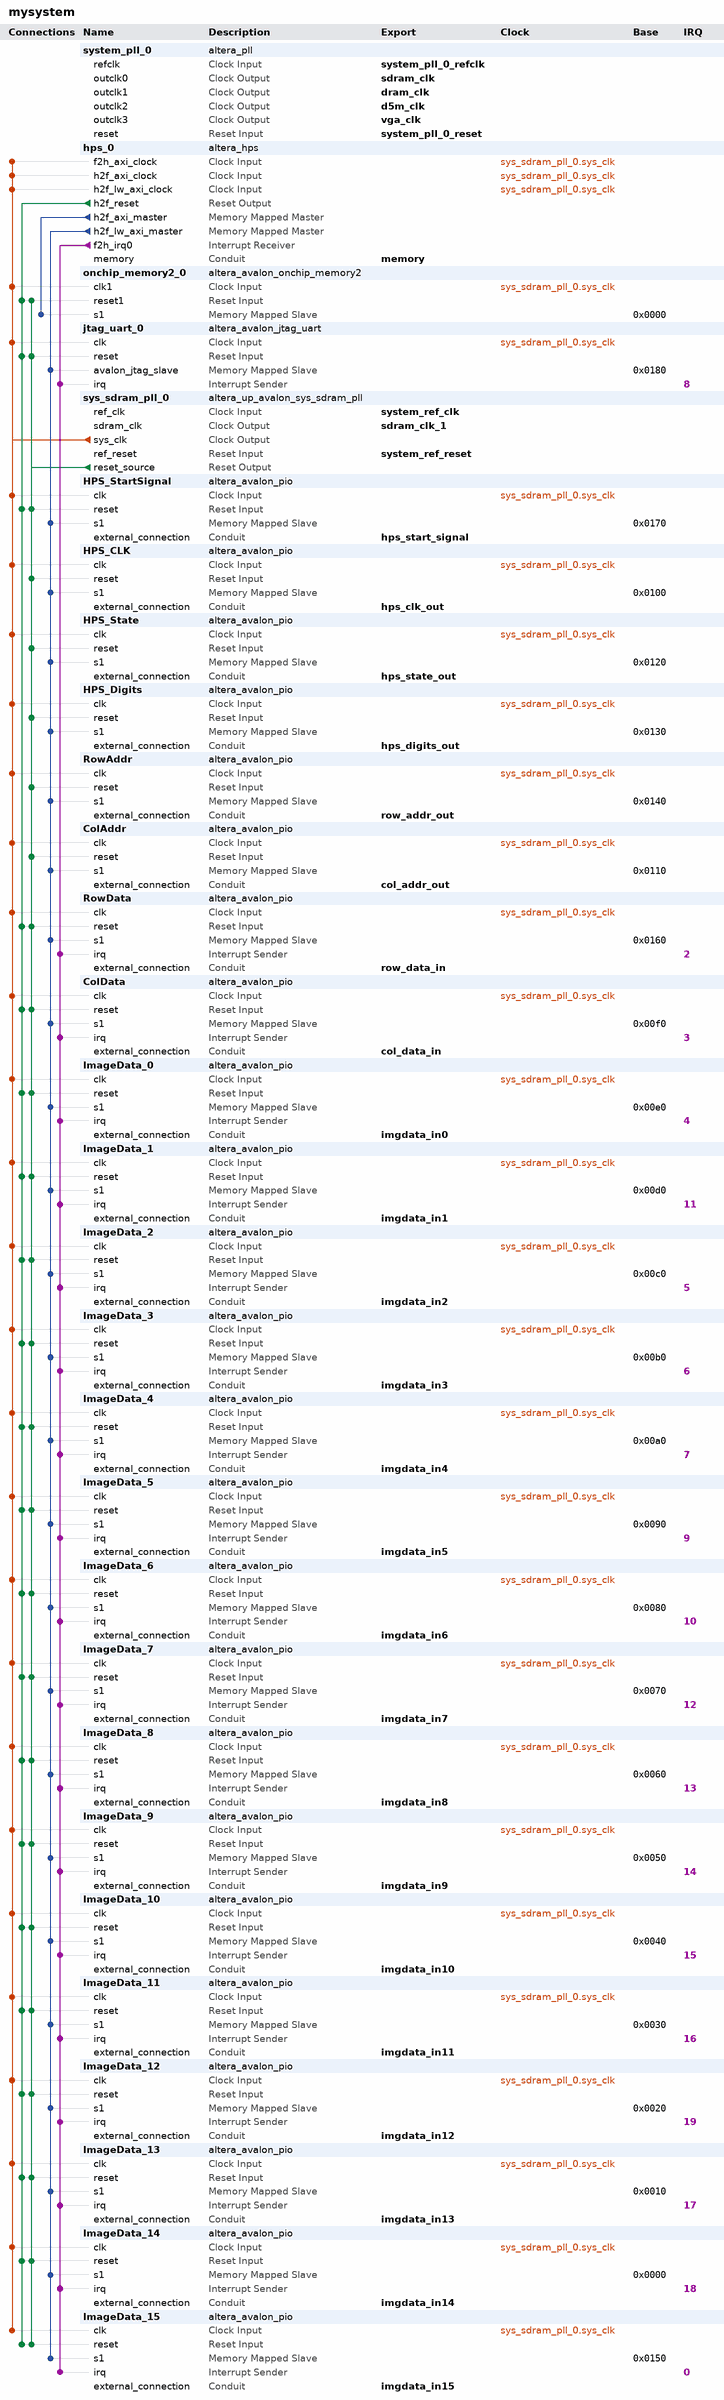
[diagram p0: system contents]
# Platform Designer (Qsys) system mysystem, Cyclone V 5CSEMA5F31C6
# Parameters at their usual value, and those the tool derives, are not listed.
package require -exact qsys 13.1
create_system mysystem
set_project_property DEVICE_FAMILY {Cyclone V}
set_project_property DEVICE 5CSEMA5F31C6

add_instance system_pll_0 altera_pll 13.1
set_instance_parameter_value system_pll_0 gui_device_speed_grade 2
set_instance_parameter_value system_pll_0 gui_pll_mode {Integer-N PLL}
set_instance_parameter_value system_pll_0 gui_reference_clock_frequency 50.0
set_instance_parameter_value system_pll_0 gui_operation_mode direct
set_instance_parameter_value system_pll_0 gui_use_locked false
set_instance_parameter_value system_pll_0 gui_number_of_clocks 4
set_instance_parameter_value system_pll_0 gui_output_clock_frequency0 100.0
set_instance_parameter_value system_pll_0 gui_output_clock_frequency1 100.0
set_instance_parameter_value system_pll_0 gui_ps_units1 degrees
set_instance_parameter_value system_pll_0 gui_phase_shift_deg1 -90.0
set_instance_parameter_value system_pll_0 gui_output_clock_frequency2 25.0
set_instance_parameter_value system_pll_0 gui_output_clock_frequency3 25.0

add_instance hps_0 altera_hps 13.1
set_instance_parameter_value hps_0 MEM_VENDOR JEDEC
set_instance_parameter_value hps_0 MEM_CLK_FREQ_MAX 400.0
set_instance_parameter_value hps_0 MEM_ROW_ADDR_WIDTH 12
set_instance_parameter_value hps_0 MEM_COL_ADDR_WIDTH 8
set_instance_parameter_value hps_0 MEM_DQ_WIDTH 8
set_instance_parameter_value hps_0 MEM_BANKADDR_WIDTH 3
set_instance_parameter_value hps_0 MEM_DRV_STR RZQ/6
set_instance_parameter_value hps_0 MEM_RTT_NOM RZQ/6
set_instance_parameter_value hps_0 MEM_RTT_WR {Dynamic ODT off}
set_instance_parameter_value hps_0 MEM_WTCL 6
set_instance_parameter_value hps_0 MEM_TCL 7
set_instance_parameter_value hps_0 TIMING_TIS 175
set_instance_parameter_value hps_0 TIMING_TIH 250
set_instance_parameter_value hps_0 TIMING_TDS 50
set_instance_parameter_value hps_0 TIMING_TDH 125
set_instance_parameter_value hps_0 TIMING_TDQSQ 120
set_instance_parameter_value hps_0 TIMING_TDQSCK 400
set_instance_parameter_value hps_0 TIMING_TQSH 0.38
set_instance_parameter_value hps_0 MEM_TINIT_US 499
set_instance_parameter_value hps_0 MEM_TMRD_CK 3
set_instance_parameter_value hps_0 MEM_TRAS_NS 40.0
set_instance_parameter_value hps_0 MEM_TRCD_NS 15.0
set_instance_parameter_value hps_0 MEM_TRP_NS 15.0
set_instance_parameter_value hps_0 MEM_TREFI_US 7.0
set_instance_parameter_value hps_0 MEM_TRFC_NS 75.0
set_instance_parameter_value hps_0 MEM_TWTR 2
set_instance_parameter_value hps_0 MEM_TFAW_NS 37.5
set_instance_parameter_value hps_0 REF_CLK_FREQ 125.0
set_instance_parameter_value hps_0 DEFAULT_FAST_SIM_MODEL true
set_instance_parameter_value hps_0 TIMING_BOARD_MAX_CK_DELAY 0.6
set_instance_parameter_value hps_0 TIMING_BOARD_MAX_DQS_DELAY 0.6
set_instance_parameter_value hps_0 TIMING_BOARD_SKEW_CKDQS_DIMM_MIN -0.01
set_instance_parameter_value hps_0 TIMING_BOARD_SKEW_CKDQS_DIMM_MAX 0.01
set_instance_parameter_value hps_0 TIMING_BOARD_SKEW_WITHIN_DQS 0.02
set_instance_parameter_value hps_0 TIMING_BOARD_SKEW_BETWEEN_DQS 0.02
set_instance_parameter_value hps_0 TIMING_BOARD_DQ_TO_DQS_SKEW 0.0
set_instance_parameter_value hps_0 TIMING_BOARD_AC_SKEW 0.02
set_instance_parameter_value hps_0 TIMING_BOARD_AC_TO_CK_SKEW 0.0
set_instance_parameter_value hps_0 MEM_CLK_FREQ 300.0
set_instance_parameter_value hps_0 HPS_PROTOCOL DDR3
set_instance_parameter_value hps_0 STM_Enable false
set_instance_parameter_value hps_0 F2S_Width 2
set_instance_parameter_value hps_0 S2F_Width 3
set_instance_parameter_value hps_0 LWH2F_Enable true
set_instance_parameter_value hps_0 F2SCLK_DBGRST_Enable false
set_instance_parameter_value hps_0 F2SCLK_WARMRST_Enable false
set_instance_parameter_value hps_0 F2SCLK_COLDRST_Enable false
set_instance_parameter_value hps_0 F2SINTERRUPT_Enable true
set_instance_parameter_value hps_0 EMAC1_PinMuxing Unused
set_instance_parameter_value hps_0 EMAC1_Mode N/A
set_instance_parameter_value hps_0 QSPI_PinMuxing Unused
set_instance_parameter_value hps_0 QSPI_Mode N/A
set_instance_parameter_value hps_0 SDIO_PinMuxing Unused
set_instance_parameter_value hps_0 SDIO_Mode N/A
set_instance_parameter_value hps_0 USB1_PinMuxing Unused
set_instance_parameter_value hps_0 USB1_Mode N/A
set_instance_parameter_value hps_0 SPIM1_PinMuxing Unused
set_instance_parameter_value hps_0 SPIM1_Mode N/A
set_instance_parameter_value hps_0 UART0_PinMuxing Unused
set_instance_parameter_value hps_0 UART0_Mode N/A
set_instance_parameter_value hps_0 I2C0_PinMuxing Unused
set_instance_parameter_value hps_0 I2C0_Mode N/A
set_instance_parameter_value hps_0 I2C1_PinMuxing Unused
set_instance_parameter_value hps_0 I2C1_Mode N/A
set_instance_parameter_value hps_0 S2FCLK_USER1CLK_FREQ 100
set_instance_parameter_value hps_0 FPGA_PERIPHERAL_OUTPUT_CLOCK_FREQ_EMAC0_MD_CLK 100
set_instance_parameter_value hps_0 FPGA_PERIPHERAL_OUTPUT_CLOCK_FREQ_EMAC0_GTX_CLK 100
set_instance_parameter_value hps_0 FPGA_PERIPHERAL_OUTPUT_CLOCK_FREQ_EMAC1_MD_CLK 100
set_instance_parameter_value hps_0 FPGA_PERIPHERAL_OUTPUT_CLOCK_FREQ_EMAC1_GTX_CLK 100

add_instance onchip_memory2_0 altera_avalon_onchip_memory2 13.1
set_instance_parameter_value onchip_memory2_0 dataWidth 32
set_instance_parameter_value onchip_memory2_0 dualPort false
set_instance_parameter_value onchip_memory2_0 initMemContent true
set_instance_parameter_value onchip_memory2_0 initializationFileName onchip_mem.hex
set_instance_parameter_value onchip_memory2_0 memorySize 16384

add_instance jtag_uart_0 altera_avalon_jtag_uart 13.1
set_instance_parameter_value jtag_uart_0 simInteractiveOptions NO_INTERACTIVE_WINDOWS

add_instance sys_sdram_pll_0 altera_up_avalon_sys_sdram_pll 13.1
set_instance_parameter_value sys_sdram_pll_0 gui_refclk 50.0
set_instance_parameter_value sys_sdram_pll_0 gui_outclk 50.0
set_instance_parameter_value sys_sdram_pll_0 CV_boards DE1-SoC

add_instance HPS_StartSignal altera_avalon_pio 13.1
set_instance_parameter_value HPS_StartSignal direction Output
set_instance_parameter_value HPS_StartSignal width 1

add_instance HPS_CLK altera_avalon_pio 13.1
set_instance_parameter_value HPS_CLK direction Output
set_instance_parameter_value HPS_CLK width 1

add_instance HPS_State altera_avalon_pio 13.1
set_instance_parameter_value HPS_State direction Output
set_instance_parameter_value HPS_State width 10

add_instance HPS_Digits altera_avalon_pio 13.1
set_instance_parameter_value HPS_Digits direction Output
set_instance_parameter_value HPS_Digits width 32

add_instance RowAddr altera_avalon_pio 13.1
set_instance_parameter_value RowAddr direction Output
set_instance_parameter_value RowAddr width 32

add_instance ColAddr altera_avalon_pio 13.1
set_instance_parameter_value ColAddr bitClearingEdgeCapReg true
set_instance_parameter_value ColAddr captureEdge true
set_instance_parameter_value ColAddr direction Output
set_instance_parameter_value ColAddr edgeType FALLING
set_instance_parameter_value ColAddr generateIRQ true
set_instance_parameter_value ColAddr irqType EDGE
set_instance_parameter_value ColAddr simDoTestBenchWiring true
set_instance_parameter_value ColAddr width 32

add_instance RowData altera_avalon_pio 13.1
set_instance_parameter_value RowData bitClearingEdgeCapReg true
set_instance_parameter_value RowData captureEdge true
set_instance_parameter_value RowData direction Input
set_instance_parameter_value RowData edgeType FALLING
set_instance_parameter_value RowData generateIRQ true
set_instance_parameter_value RowData irqType EDGE
set_instance_parameter_value RowData simDoTestBenchWiring true
set_instance_parameter_value RowData width 32

add_instance ColData altera_avalon_pio 13.1
set_instance_parameter_value ColData bitClearingEdgeCapReg true
set_instance_parameter_value ColData captureEdge true
set_instance_parameter_value ColData direction Input
set_instance_parameter_value ColData edgeType FALLING
set_instance_parameter_value ColData generateIRQ true
set_instance_parameter_value ColData irqType EDGE
set_instance_parameter_value ColData simDoTestBenchWiring true
set_instance_parameter_value ColData width 32

add_instance ImageData_0 altera_avalon_pio 13.1
set_instance_parameter_value ImageData_0 bitClearingEdgeCapReg true
set_instance_parameter_value ImageData_0 captureEdge true
set_instance_parameter_value ImageData_0 direction Input
set_instance_parameter_value ImageData_0 edgeType FALLING
set_instance_parameter_value ImageData_0 generateIRQ true
set_instance_parameter_value ImageData_0 irqType EDGE
set_instance_parameter_value ImageData_0 simDoTestBenchWiring true
set_instance_parameter_value ImageData_0 width 32

add_instance ImageData_1 altera_avalon_pio 13.1
set_instance_parameter_value ImageData_1 bitClearingEdgeCapReg true
set_instance_parameter_value ImageData_1 captureEdge true
set_instance_parameter_value ImageData_1 direction Input
set_instance_parameter_value ImageData_1 edgeType FALLING
set_instance_parameter_value ImageData_1 generateIRQ true
set_instance_parameter_value ImageData_1 irqType EDGE
set_instance_parameter_value ImageData_1 simDoTestBenchWiring true
set_instance_parameter_value ImageData_1 width 32

add_instance ImageData_2 altera_avalon_pio 13.1
set_instance_parameter_value ImageData_2 bitClearingEdgeCapReg true
set_instance_parameter_value ImageData_2 captureEdge true
set_instance_parameter_value ImageData_2 direction Input
set_instance_parameter_value ImageData_2 edgeType FALLING
set_instance_parameter_value ImageData_2 generateIRQ true
set_instance_parameter_value ImageData_2 irqType EDGE
set_instance_parameter_value ImageData_2 simDoTestBenchWiring true
set_instance_parameter_value ImageData_2 width 32

add_instance ImageData_3 altera_avalon_pio 13.1
set_instance_parameter_value ImageData_3 bitClearingEdgeCapReg true
set_instance_parameter_value ImageData_3 captureEdge true
set_instance_parameter_value ImageData_3 direction Input
set_instance_parameter_value ImageData_3 edgeType FALLING
set_instance_parameter_value ImageData_3 generateIRQ true
set_instance_parameter_value ImageData_3 irqType EDGE
set_instance_parameter_value ImageData_3 simDoTestBenchWiring true
set_instance_parameter_value ImageData_3 width 32

add_instance ImageData_4 altera_avalon_pio 13.1
set_instance_parameter_value ImageData_4 bitClearingEdgeCapReg true
set_instance_parameter_value ImageData_4 captureEdge true
set_instance_parameter_value ImageData_4 direction Input
set_instance_parameter_value ImageData_4 edgeType FALLING
set_instance_parameter_value ImageData_4 generateIRQ true
set_instance_parameter_value ImageData_4 irqType EDGE
set_instance_parameter_value ImageData_4 simDoTestBenchWiring true
set_instance_parameter_value ImageData_4 width 32

add_instance ImageData_5 altera_avalon_pio 13.1
set_instance_parameter_value ImageData_5 bitClearingEdgeCapReg true
set_instance_parameter_value ImageData_5 captureEdge true
set_instance_parameter_value ImageData_5 direction Input
set_instance_parameter_value ImageData_5 edgeType FALLING
set_instance_parameter_value ImageData_5 generateIRQ true
set_instance_parameter_value ImageData_5 irqType EDGE
set_instance_parameter_value ImageData_5 simDoTestBenchWiring true
set_instance_parameter_value ImageData_5 width 32

add_instance ImageData_6 altera_avalon_pio 13.1
set_instance_parameter_value ImageData_6 bitClearingEdgeCapReg true
set_instance_parameter_value ImageData_6 captureEdge true
set_instance_parameter_value ImageData_6 direction Input
set_instance_parameter_value ImageData_6 edgeType FALLING
set_instance_parameter_value ImageData_6 generateIRQ true
set_instance_parameter_value ImageData_6 irqType EDGE
set_instance_parameter_value ImageData_6 simDoTestBenchWiring true
set_instance_parameter_value ImageData_6 width 32

add_instance ImageData_7 altera_avalon_pio 13.1
set_instance_parameter_value ImageData_7 bitClearingEdgeCapReg true
set_instance_parameter_value ImageData_7 captureEdge true
set_instance_parameter_value ImageData_7 direction Input
set_instance_parameter_value ImageData_7 edgeType FALLING
set_instance_parameter_value ImageData_7 generateIRQ true
set_instance_parameter_value ImageData_7 irqType EDGE
set_instance_parameter_value ImageData_7 simDoTestBenchWiring true
set_instance_parameter_value ImageData_7 width 32

add_instance ImageData_8 altera_avalon_pio 13.1
set_instance_parameter_value ImageData_8 bitClearingEdgeCapReg true
set_instance_parameter_value ImageData_8 captureEdge true
set_instance_parameter_value ImageData_8 direction Input
set_instance_parameter_value ImageData_8 edgeType FALLING
set_instance_parameter_value ImageData_8 generateIRQ true
set_instance_parameter_value ImageData_8 irqType EDGE
set_instance_parameter_value ImageData_8 simDoTestBenchWiring true
set_instance_parameter_value ImageData_8 width 32

add_instance ImageData_9 altera_avalon_pio 13.1
set_instance_parameter_value ImageData_9 bitClearingEdgeCapReg true
set_instance_parameter_value ImageData_9 captureEdge true
set_instance_parameter_value ImageData_9 direction Input
set_instance_parameter_value ImageData_9 edgeType FALLING
set_instance_parameter_value ImageData_9 generateIRQ true
set_instance_parameter_value ImageData_9 irqType EDGE
set_instance_parameter_value ImageData_9 simDoTestBenchWiring true
set_instance_parameter_value ImageData_9 width 32

add_instance ImageData_10 altera_avalon_pio 13.1
set_instance_parameter_value ImageData_10 bitClearingEdgeCapReg true
set_instance_parameter_value ImageData_10 captureEdge true
set_instance_parameter_value ImageData_10 direction Input
set_instance_parameter_value ImageData_10 edgeType FALLING
set_instance_parameter_value ImageData_10 generateIRQ true
set_instance_parameter_value ImageData_10 irqType EDGE
set_instance_parameter_value ImageData_10 simDoTestBenchWiring true
set_instance_parameter_value ImageData_10 width 32

add_instance ImageData_11 altera_avalon_pio 13.1
set_instance_parameter_value ImageData_11 bitClearingEdgeCapReg true
set_instance_parameter_value ImageData_11 captureEdge true
set_instance_parameter_value ImageData_11 direction Input
set_instance_parameter_value ImageData_11 edgeType FALLING
set_instance_parameter_value ImageData_11 generateIRQ true
set_instance_parameter_value ImageData_11 irqType EDGE
set_instance_parameter_value ImageData_11 simDoTestBenchWiring true
set_instance_parameter_value ImageData_11 width 32

add_instance ImageData_12 altera_avalon_pio 13.1
set_instance_parameter_value ImageData_12 bitClearingEdgeCapReg true
set_instance_parameter_value ImageData_12 captureEdge true
set_instance_parameter_value ImageData_12 direction Input
set_instance_parameter_value ImageData_12 edgeType FALLING
set_instance_parameter_value ImageData_12 generateIRQ true
set_instance_parameter_value ImageData_12 irqType EDGE
set_instance_parameter_value ImageData_12 simDoTestBenchWiring true
set_instance_parameter_value ImageData_12 width 32

add_instance ImageData_13 altera_avalon_pio 13.1
set_instance_parameter_value ImageData_13 bitClearingEdgeCapReg true
set_instance_parameter_value ImageData_13 captureEdge true
set_instance_parameter_value ImageData_13 direction Input
set_instance_parameter_value ImageData_13 edgeType FALLING
set_instance_parameter_value ImageData_13 generateIRQ true
set_instance_parameter_value ImageData_13 irqType EDGE
set_instance_parameter_value ImageData_13 simDoTestBenchWiring true
set_instance_parameter_value ImageData_13 width 32

add_instance ImageData_14 altera_avalon_pio 13.1
set_instance_parameter_value ImageData_14 bitClearingEdgeCapReg true
set_instance_parameter_value ImageData_14 captureEdge true
set_instance_parameter_value ImageData_14 direction Input
set_instance_parameter_value ImageData_14 edgeType FALLING
set_instance_parameter_value ImageData_14 generateIRQ true
set_instance_parameter_value ImageData_14 irqType EDGE
set_instance_parameter_value ImageData_14 simDoTestBenchWiring true
set_instance_parameter_value ImageData_14 width 32

add_instance ImageData_15 altera_avalon_pio 13.1
set_instance_parameter_value ImageData_15 bitClearingEdgeCapReg true
set_instance_parameter_value ImageData_15 captureEdge true
set_instance_parameter_value ImageData_15 direction Input
set_instance_parameter_value ImageData_15 edgeType FALLING
set_instance_parameter_value ImageData_15 generateIRQ true
set_instance_parameter_value ImageData_15 irqType EDGE
set_instance_parameter_value ImageData_15 simDoTestBenchWiring true
set_instance_parameter_value ImageData_15 width 32

# connections
add_connection sys_sdram_pll_0.sys_clk ColAddr.clk clock
add_connection sys_sdram_pll_0.sys_clk ColData.clk clock
add_connection sys_sdram_pll_0.sys_clk hps_0.f2h_axi_clock clock
add_connection sys_sdram_pll_0.sys_clk hps_0.h2f_axi_clock clock
add_connection sys_sdram_pll_0.sys_clk hps_0.h2f_lw_axi_clock clock
add_connection sys_sdram_pll_0.sys_clk HPS_CLK.clk clock
add_connection sys_sdram_pll_0.sys_clk HPS_Digits.clk clock
add_connection sys_sdram_pll_0.sys_clk HPS_StartSignal.clk clock
add_connection sys_sdram_pll_0.sys_clk HPS_State.clk clock
add_connection sys_sdram_pll_0.sys_clk ImageData_0.clk clock
add_connection sys_sdram_pll_0.sys_clk ImageData_1.clk clock
add_connection sys_sdram_pll_0.sys_clk ImageData_2.clk clock
add_connection sys_sdram_pll_0.sys_clk ImageData_3.clk clock
add_connection sys_sdram_pll_0.sys_clk ImageData_4.clk clock
add_connection sys_sdram_pll_0.sys_clk ImageData_5.clk clock
add_connection sys_sdram_pll_0.sys_clk ImageData_6.clk clock
add_connection sys_sdram_pll_0.sys_clk ImageData_7.clk clock
add_connection sys_sdram_pll_0.sys_clk ImageData_8.clk clock
add_connection sys_sdram_pll_0.sys_clk ImageData_9.clk clock
add_connection sys_sdram_pll_0.sys_clk ImageData_10.clk clock
add_connection sys_sdram_pll_0.sys_clk ImageData_11.clk clock
add_connection sys_sdram_pll_0.sys_clk ImageData_12.clk clock
add_connection sys_sdram_pll_0.sys_clk ImageData_13.clk clock
add_connection sys_sdram_pll_0.sys_clk ImageData_14.clk clock
add_connection sys_sdram_pll_0.sys_clk ImageData_15.clk clock
add_connection sys_sdram_pll_0.sys_clk jtag_uart_0.clk clock
add_connection sys_sdram_pll_0.sys_clk onchip_memory2_0.clk1 clock
add_connection sys_sdram_pll_0.sys_clk RowAddr.clk clock
add_connection sys_sdram_pll_0.sys_clk RowData.clk clock
add_connection hps_0.h2f_reset ColData.reset reset
add_connection hps_0.h2f_reset HPS_StartSignal.reset reset
add_connection hps_0.h2f_reset ImageData_0.reset reset
add_connection hps_0.h2f_reset ImageData_1.reset reset
add_connection hps_0.h2f_reset ImageData_2.reset reset
add_connection hps_0.h2f_reset ImageData_3.reset reset
add_connection hps_0.h2f_reset ImageData_4.reset reset
add_connection hps_0.h2f_reset ImageData_5.reset reset
add_connection hps_0.h2f_reset ImageData_6.reset reset
add_connection hps_0.h2f_reset ImageData_7.reset reset
add_connection hps_0.h2f_reset ImageData_8.reset reset
add_connection hps_0.h2f_reset ImageData_9.reset reset
add_connection hps_0.h2f_reset ImageData_10.reset reset
add_connection hps_0.h2f_reset ImageData_11.reset reset
add_connection hps_0.h2f_reset ImageData_12.reset reset
add_connection hps_0.h2f_reset ImageData_13.reset reset
add_connection hps_0.h2f_reset ImageData_14.reset reset
add_connection hps_0.h2f_reset ImageData_15.reset reset
add_connection hps_0.h2f_reset jtag_uart_0.reset reset
add_connection hps_0.h2f_reset onchip_memory2_0.reset1 reset
add_connection hps_0.h2f_reset RowData.reset reset
add_connection sys_sdram_pll_0.reset_source ColAddr.reset reset
add_connection sys_sdram_pll_0.reset_source ColData.reset reset
add_connection sys_sdram_pll_0.reset_source HPS_CLK.reset reset
add_connection sys_sdram_pll_0.reset_source HPS_Digits.reset reset
add_connection sys_sdram_pll_0.reset_source HPS_StartSignal.reset reset
add_connection sys_sdram_pll_0.reset_source HPS_State.reset reset
add_connection sys_sdram_pll_0.reset_source ImageData_0.reset reset
add_connection sys_sdram_pll_0.reset_source ImageData_1.reset reset
add_connection sys_sdram_pll_0.reset_source ImageData_2.reset reset
add_connection sys_sdram_pll_0.reset_source ImageData_3.reset reset
add_connection sys_sdram_pll_0.reset_source ImageData_4.reset reset
add_connection sys_sdram_pll_0.reset_source ImageData_5.reset reset
add_connection sys_sdram_pll_0.reset_source ImageData_6.reset reset
add_connection sys_sdram_pll_0.reset_source ImageData_7.reset reset
add_connection sys_sdram_pll_0.reset_source ImageData_8.reset reset
add_connection sys_sdram_pll_0.reset_source ImageData_9.reset reset
add_connection sys_sdram_pll_0.reset_source ImageData_10.reset reset
add_connection sys_sdram_pll_0.reset_source ImageData_11.reset reset
add_connection sys_sdram_pll_0.reset_source ImageData_12.reset reset
add_connection sys_sdram_pll_0.reset_source ImageData_13.reset reset
add_connection sys_sdram_pll_0.reset_source ImageData_14.reset reset
add_connection sys_sdram_pll_0.reset_source ImageData_15.reset reset
add_connection sys_sdram_pll_0.reset_source jtag_uart_0.reset reset
add_connection sys_sdram_pll_0.reset_source onchip_memory2_0.reset1 reset
add_connection sys_sdram_pll_0.reset_source RowAddr.reset reset
add_connection sys_sdram_pll_0.reset_source RowData.reset reset
add_connection hps_0.h2f_axi_master onchip_memory2_0.s1 avalon
set_connection_parameter_value hps_0.h2f_axi_master/onchip_memory2_0.s1 baseAddress 0x0000
add_connection hps_0.h2f_lw_axi_master ColAddr.s1 avalon
set_connection_parameter_value hps_0.h2f_lw_axi_master/ColAddr.s1 baseAddress 0x0110
add_connection hps_0.h2f_lw_axi_master ColData.s1 avalon
set_connection_parameter_value hps_0.h2f_lw_axi_master/ColData.s1 baseAddress 0x00f0
add_connection hps_0.h2f_lw_axi_master HPS_CLK.s1 avalon
set_connection_parameter_value hps_0.h2f_lw_axi_master/HPS_CLK.s1 baseAddress 0x0100
add_connection hps_0.h2f_lw_axi_master HPS_Digits.s1 avalon
set_connection_parameter_value hps_0.h2f_lw_axi_master/HPS_Digits.s1 baseAddress 0x0130
add_connection hps_0.h2f_lw_axi_master HPS_StartSignal.s1 avalon
set_connection_parameter_value hps_0.h2f_lw_axi_master/HPS_StartSignal.s1 baseAddress 0x0170
add_connection hps_0.h2f_lw_axi_master HPS_State.s1 avalon
set_connection_parameter_value hps_0.h2f_lw_axi_master/HPS_State.s1 baseAddress 0x0120
add_connection hps_0.h2f_lw_axi_master ImageData_0.s1 avalon
set_connection_parameter_value hps_0.h2f_lw_axi_master/ImageData_0.s1 baseAddress 0x00e0
add_connection hps_0.h2f_lw_axi_master ImageData_1.s1 avalon
set_connection_parameter_value hps_0.h2f_lw_axi_master/ImageData_1.s1 baseAddress 0x00d0
add_connection hps_0.h2f_lw_axi_master ImageData_2.s1 avalon
set_connection_parameter_value hps_0.h2f_lw_axi_master/ImageData_2.s1 baseAddress 0x00c0
add_connection hps_0.h2f_lw_axi_master ImageData_3.s1 avalon
set_connection_parameter_value hps_0.h2f_lw_axi_master/ImageData_3.s1 baseAddress 0x00b0
add_connection hps_0.h2f_lw_axi_master ImageData_4.s1 avalon
set_connection_parameter_value hps_0.h2f_lw_axi_master/ImageData_4.s1 baseAddress 0x00a0
add_connection hps_0.h2f_lw_axi_master ImageData_5.s1 avalon
set_connection_parameter_value hps_0.h2f_lw_axi_master/ImageData_5.s1 baseAddress 0x0090
add_connection hps_0.h2f_lw_axi_master ImageData_6.s1 avalon
set_connection_parameter_value hps_0.h2f_lw_axi_master/ImageData_6.s1 baseAddress 0x0080
add_connection hps_0.h2f_lw_axi_master ImageData_7.s1 avalon
set_connection_parameter_value hps_0.h2f_lw_axi_master/ImageData_7.s1 baseAddress 0x0070
add_connection hps_0.h2f_lw_axi_master ImageData_8.s1 avalon
set_connection_parameter_value hps_0.h2f_lw_axi_master/ImageData_8.s1 baseAddress 0x0060
add_connection hps_0.h2f_lw_axi_master ImageData_9.s1 avalon
set_connection_parameter_value hps_0.h2f_lw_axi_master/ImageData_9.s1 baseAddress 0x0050
add_connection hps_0.h2f_lw_axi_master ImageData_10.s1 avalon
set_connection_parameter_value hps_0.h2f_lw_axi_master/ImageData_10.s1 baseAddress 0x0040
add_connection hps_0.h2f_lw_axi_master ImageData_11.s1 avalon
set_connection_parameter_value hps_0.h2f_lw_axi_master/ImageData_11.s1 baseAddress 0x0030
add_connection hps_0.h2f_lw_axi_master ImageData_12.s1 avalon
set_connection_parameter_value hps_0.h2f_lw_axi_master/ImageData_12.s1 baseAddress 0x0020
add_connection hps_0.h2f_lw_axi_master ImageData_13.s1 avalon
set_connection_parameter_value hps_0.h2f_lw_axi_master/ImageData_13.s1 baseAddress 0x0010
add_connection hps_0.h2f_lw_axi_master ImageData_14.s1 avalon
set_connection_parameter_value hps_0.h2f_lw_axi_master/ImageData_14.s1 baseAddress 0x0000
add_connection hps_0.h2f_lw_axi_master ImageData_15.s1 avalon
set_connection_parameter_value hps_0.h2f_lw_axi_master/ImageData_15.s1 baseAddress 0x0150
add_connection hps_0.h2f_lw_axi_master jtag_uart_0.avalon_jtag_slave avalon
set_connection_parameter_value hps_0.h2f_lw_axi_master/jtag_uart_0.avalon_jtag_slave baseAddress 0x0180
add_connection hps_0.h2f_lw_axi_master RowAddr.s1 avalon
set_connection_parameter_value hps_0.h2f_lw_axi_master/RowAddr.s1 baseAddress 0x0140
add_connection hps_0.h2f_lw_axi_master RowData.s1 avalon
set_connection_parameter_value hps_0.h2f_lw_axi_master/RowData.s1 baseAddress 0x0160
add_connection hps_0.f2h_irq0 ColData.irq interrupt
set_connection_parameter_value hps_0.f2h_irq0/ColData.irq irqNumber 3
add_connection hps_0.f2h_irq0 ImageData_0.irq interrupt
set_connection_parameter_value hps_0.f2h_irq0/ImageData_0.irq irqNumber 4
add_connection hps_0.f2h_irq0 ImageData_1.irq interrupt
set_connection_parameter_value hps_0.f2h_irq0/ImageData_1.irq irqNumber 11
add_connection hps_0.f2h_irq0 ImageData_2.irq interrupt
set_connection_parameter_value hps_0.f2h_irq0/ImageData_2.irq irqNumber 5
add_connection hps_0.f2h_irq0 ImageData_3.irq interrupt
set_connection_parameter_value hps_0.f2h_irq0/ImageData_3.irq irqNumber 6
add_connection hps_0.f2h_irq0 ImageData_4.irq interrupt
set_connection_parameter_value hps_0.f2h_irq0/ImageData_4.irq irqNumber 7
add_connection hps_0.f2h_irq0 ImageData_5.irq interrupt
set_connection_parameter_value hps_0.f2h_irq0/ImageData_5.irq irqNumber 9
add_connection hps_0.f2h_irq0 ImageData_6.irq interrupt
set_connection_parameter_value hps_0.f2h_irq0/ImageData_6.irq irqNumber 10
add_connection hps_0.f2h_irq0 ImageData_7.irq interrupt
set_connection_parameter_value hps_0.f2h_irq0/ImageData_7.irq irqNumber 12
add_connection hps_0.f2h_irq0 ImageData_8.irq interrupt
set_connection_parameter_value hps_0.f2h_irq0/ImageData_8.irq irqNumber 13
add_connection hps_0.f2h_irq0 ImageData_9.irq interrupt
set_connection_parameter_value hps_0.f2h_irq0/ImageData_9.irq irqNumber 14
add_connection hps_0.f2h_irq0 ImageData_10.irq interrupt
set_connection_parameter_value hps_0.f2h_irq0/ImageData_10.irq irqNumber 15
add_connection hps_0.f2h_irq0 ImageData_11.irq interrupt
set_connection_parameter_value hps_0.f2h_irq0/ImageData_11.irq irqNumber 16
add_connection hps_0.f2h_irq0 ImageData_12.irq interrupt
set_connection_parameter_value hps_0.f2h_irq0/ImageData_12.irq irqNumber 19
add_connection hps_0.f2h_irq0 ImageData_13.irq interrupt
set_connection_parameter_value hps_0.f2h_irq0/ImageData_13.irq irqNumber 17
add_connection hps_0.f2h_irq0 ImageData_14.irq interrupt
set_connection_parameter_value hps_0.f2h_irq0/ImageData_14.irq irqNumber 18
add_connection hps_0.f2h_irq0 ImageData_15.irq interrupt
set_connection_parameter_value hps_0.f2h_irq0/ImageData_15.irq irqNumber 0
add_connection hps_0.f2h_irq0 jtag_uart_0.irq interrupt
set_connection_parameter_value hps_0.f2h_irq0/jtag_uart_0.irq irqNumber 8
add_connection hps_0.f2h_irq0 RowData.irq interrupt
set_connection_parameter_value hps_0.f2h_irq0/RowData.irq irqNumber 2

# exported interfaces
add_interface sdram_clk clock source
set_interface_property sdram_clk EXPORT_OF system_pll_0.outclk0
add_interface dram_clk clock source
set_interface_property dram_clk EXPORT_OF system_pll_0.outclk1
add_interface d5m_clk clock source
set_interface_property d5m_clk EXPORT_OF system_pll_0.outclk2
add_interface vga_clk clock source
set_interface_property vga_clk EXPORT_OF system_pll_0.outclk3
add_interface system_pll_0_refclk clock sink
set_interface_property system_pll_0_refclk EXPORT_OF system_pll_0.refclk
add_interface system_pll_0_reset reset sink
set_interface_property system_pll_0_reset EXPORT_OF system_pll_0.reset
add_interface memory conduit end
set_interface_property memory EXPORT_OF hps_0.memory
add_interface hps_start_signal conduit end
set_interface_property hps_start_signal EXPORT_OF HPS_StartSignal.external_connection
add_interface system_ref_clk clock sink
set_interface_property system_ref_clk EXPORT_OF sys_sdram_pll_0.ref_clk
add_interface sdram_clk_1 clock source
set_interface_property sdram_clk_1 EXPORT_OF sys_sdram_pll_0.sdram_clk
add_interface system_ref_reset reset sink
set_interface_property system_ref_reset EXPORT_OF sys_sdram_pll_0.ref_reset
add_interface imgdata_in15 conduit end
set_interface_property imgdata_in15 EXPORT_OF ImageData_15.external_connection
add_interface row_data_in conduit end
set_interface_property row_data_in EXPORT_OF RowData.external_connection
add_interface hps_state_out conduit end
set_interface_property hps_state_out EXPORT_OF HPS_State.external_connection
add_interface row_addr_out conduit end
set_interface_property row_addr_out EXPORT_OF RowAddr.external_connection
add_interface col_addr_out conduit end
set_interface_property col_addr_out EXPORT_OF ColAddr.external_connection
add_interface hps_digits_out conduit end
set_interface_property hps_digits_out EXPORT_OF HPS_Digits.external_connection
add_interface hps_clk_out conduit end
set_interface_property hps_clk_out EXPORT_OF HPS_CLK.external_connection
add_interface col_data_in conduit end
set_interface_property col_data_in EXPORT_OF ColData.external_connection
add_interface imgdata_in0 conduit end
set_interface_property imgdata_in0 EXPORT_OF ImageData_0.external_connection
add_interface imgdata_in1 conduit end
set_interface_property imgdata_in1 EXPORT_OF ImageData_1.external_connection
add_interface imgdata_in2 conduit end
set_interface_property imgdata_in2 EXPORT_OF ImageData_2.external_connection
add_interface imgdata_in3 conduit end
set_interface_property imgdata_in3 EXPORT_OF ImageData_3.external_connection
add_interface imgdata_in4 conduit end
set_interface_property imgdata_in4 EXPORT_OF ImageData_4.external_connection
add_interface imgdata_in5 conduit end
set_interface_property imgdata_in5 EXPORT_OF ImageData_5.external_connection
add_interface imgdata_in6 conduit end
set_interface_property imgdata_in6 EXPORT_OF ImageData_6.external_connection
add_interface imgdata_in7 conduit end
set_interface_property imgdata_in7 EXPORT_OF ImageData_7.external_connection
add_interface imgdata_in8 conduit end
set_interface_property imgdata_in8 EXPORT_OF ImageData_8.external_connection
add_interface imgdata_in9 conduit end
set_interface_property imgdata_in9 EXPORT_OF ImageData_9.external_connection
add_interface imgdata_in10 conduit end
set_interface_property imgdata_in10 EXPORT_OF ImageData_10.external_connection
add_interface imgdata_in11 conduit end
set_interface_property imgdata_in11 EXPORT_OF ImageData_11.external_connection
add_interface imgdata_in12 conduit end
set_interface_property imgdata_in12 EXPORT_OF ImageData_12.external_connection
add_interface imgdata_in13 conduit end
set_interface_property imgdata_in13 EXPORT_OF ImageData_13.external_connection
add_interface imgdata_in14 conduit end
set_interface_property imgdata_in14 EXPORT_OF ImageData_14.external_connection

set_interconnect_requirement {$system} qsys_mm.clockCrossingAdapter HANDSHAKE
set_interconnect_requirement {$system} qsys_mm.maxAdditionalLatency 1
set_interconnect_requirement {$system} qsys_mm.insertDefaultSlave false

save_system mysystem.qsys
